# Altium schematic sheet ADC5G_POWER.SchDoc: FMC 5GS/s ADC/TDC
size 420 x 297 mm; Author: Agnieszka Bartkowicz; CompanyName: WUT ISE; DrawnBy: Agnieszka Bartkowicz; Engineer: Agnieszka Bartkowicz; Organization: WUT ISE; Address1: PW ISE; Address2: Nowowiejska 15/19 00-665 Warsaw; Address3: gyorka@o2.pl; SheetNumber: 5; SheetTotal: 13; ModifiedBy: -; CheckedDate: -; Title2: Title 2; DivGrp: WUT ISE; Designer: A. Bartkowicz
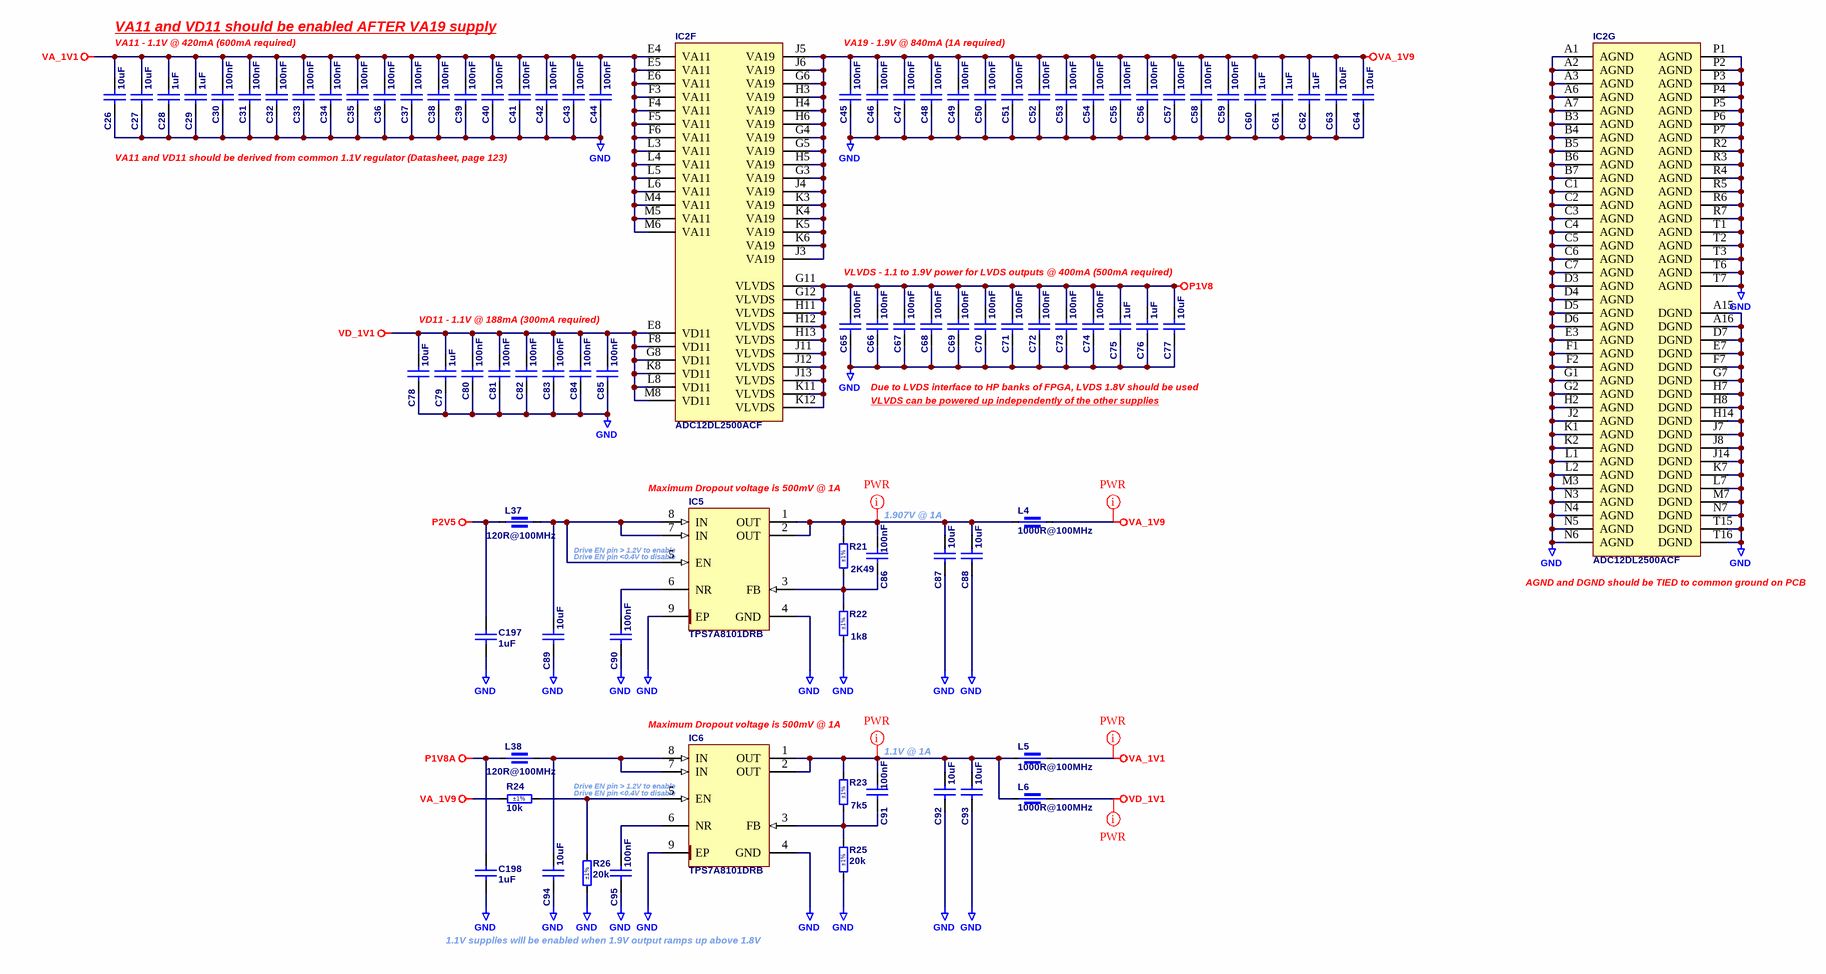
[diagram p0: ADC5G_POWER.SchDoc]

## Parts
C26  10uF  [CAPC1608X90N]
C27  10uF  [CAPC1608X90N]
C28  1uF  [CAPC1005X55N]
C29  1uF  [CAPC1005X55N]
C30  100nF  [CAPC0603X33N]
C31  100nF  [CAPC0603X33N]
C32  100nF  [CAPC0603X33N]
C33  100nF  [CAPC0603X33N]
C34  100nF  [CAPC0603X33N]
C35  100nF  [CAPC0603X33N]
C36  100nF  [CAPC0603X33N]
C37  100nF  [CAPC0603X33N]
C38  100nF  [CAPC0603X33N]
C39  100nF  [CAPC0603X33N]
C40  100nF  [CAPC0603X33N]
C41  100nF  [CAPC0603X33N]
C42  100nF  [CAPC0603X33N]
C43  100nF  [CAPC0603X33N]
C44  100nF  [CAPC0603X33N]
C45  100nF  [CAPC0603X33N]
C46  100nF  [CAPC0603X33N]
C47  100nF  [CAPC0603X33N]
C48  100nF  [CAPC0603X33N]
C49  100nF  [CAPC0603X33N]
C50  100nF  [CAPC0603X33N]
C51  100nF  [CAPC0603X33N]
C52  100nF  [CAPC0603X33N]
C53  100nF  [CAPC0603X33N]
C54  100nF  [CAPC0603X33N]
C55  100nF  [CAPC0603X33N]
C56  100nF  [CAPC0603X33N]
C57  100nF  [CAPC0603X33N]
C58  100nF  [CAPC0603X33N]
C59  100nF  [CAPC0603X33N]
C60  1uF  [CAPC1005X55N]
C61  1uF  [CAPC1005X55N]
C62  1uF  [CAPC1005X55N]
C63  10uF  [CAPC1608X90N]
C64  10uF  [CAPC1608X90N]
C65  100nF  [CAPC0603X33N]
C66  100nF  [CAPC0603X33N]
C67  100nF  [CAPC0603X33N]
C68  100nF  [CAPC0603X33N]
C69  100nF  [CAPC0603X33N]
C70  100nF  [CAPC0603X33N]
C71  100nF  [CAPC0603X33N]
C72  100nF  [CAPC0603X33N]
C73  100nF  [CAPC0603X33N]
C74  100nF  [CAPC0603X33N]
C75  1uF  [CAPC1005X55N]
C76  1uF  [CAPC1005X55N]
C77  10uF  [CAPC1608X90N]
C78  10uF  [CAPC1608X90N]
C79  1uF  [CAPC1005X55N]
C80  100nF  [CAPC0603X33N]
C81  100nF  [CAPC0603X33N]
C82  100nF  [CAPC0603X33N]
C83  100nF  [CAPC0603X33N]
C84  100nF  [CAPC0603X33N]
C85  100nF  [CAPC0603X33N]
C86  100nF  [CAPC1005X55N]
C87  10uF  [CAPC1608X90N]
C88  10uF  [CAPC1608X90N]
C89  10uF  [CAPC1608X90N]
C90  100nF  [CAPC1005X55N]
C91  100nF  [CAPC1005X55N]
C92  10uF  [CAPC1608X90N]
C93  10uF  [CAPC1608X90N]
C94  10uF  [CAPC1608X90N]
C95  100nF  [CAPC1005X55N]
C197  1uF  [CAPC1005X55N]
C198  1uF  [CAPC1005X55N]
IC2  ADC12DL2500ACF  [BGA256C100P16X16_1700X1700X331]  (parts F,G of 7)
IC5  TPS7A8101DRB  [TEXAS_DRB(S-PVSON-N8)]
IC6  TPS7A8101DRB  [TEXAS_DRB(S-PVSON-N8)]
L4  1000R@100MHz  [INDC1608X95N]
L5  1000R@100MHz  [INDC1608X95N]
L6  1000R@100MHz  [INDC1608X95N]
L37  120R@100MHz  [INDC1005X55N]
L38  120R@100MHz  [INDC1005X55N]
R21  2K49  Tolerance: ±1%  [RESC1005X40N]
R22  1k8  Tolerance: ±1%  [RESC1005X40N]
R23  7k5  Tolerance: ±1%  [RESC1005X40N]
R24  10k  Tolerance: ±1%  [RESC1005X40N]
R25  20k  Tolerance: ±1%  [RESC1005X40N]
R26  20k  Tolerance: ±1%  [RESC1005X40N]

## Nets
GND: C26.1 C27.1 C28.1 C29.1 C30.1 C31.1 C32.1 C33.1 C34.1 C35.1 C36.1 C37.1 C38.1 C39.1 C40.1 C41.1 C42.1 C43.1 C44.1 C45.1 C46.1 C47.1 C48.1 C49.1 C50.1 C51.1 C52.1 C53.1 C54.1 C55.1 C56.1 C57.1 C58.1 C59.1 C60.1 C61.1 C62.1 C63.1 C64.1 C65.1 C66.1 C67.1 C68.1 C69.1 C70.1 C71.1 C72.1 C73.1 C74.1 C75.1 C76.1 C77.1 C78.1 C79.1 C80.1 C81.1 C82.1 C83.1 C84.1 C85.1 C87.1 C88.1 C89.1 C90.1 C92.1 C93.1 C94.1 C95.1 C197.1 C198.1 IC2.A1(AGND) IC2.A2(AGND) IC2.A3(AGND) IC2.A6(AGND) IC2.A7(AGND) IC2.A15(DGND) IC2.A16(DGND) IC2.B3(AGND) IC2.B4(AGND) IC2.B5(AGND) IC2.B6(AGND) IC2.B7(AGND) IC2.C1(AGND) IC2.C2(AGND) IC2.C3(AGND) IC2.C4(AGND) IC2.C5(AGND) IC2.C6(AGND) IC2.C7(AGND) IC2.D3(AGND) IC2.D4(AGND) IC2.D5(AGND) IC2.D6(AGND) IC2.D7(DGND) IC2.E3(AGND) IC2.E7(DGND) IC2.F1(AGND) IC2.F2(AGND) IC2.F7(DGND) IC2.G1(AGND) IC2.G2(AGND) IC2.G7(DGND) IC2.H2(AGND) IC2.H7(DGND) IC2.H8(DGND) IC2.H14(DGND) IC2.J2(AGND) IC2.J7(DGND) IC2.J8(DGND) IC2.J14(DGND) IC2.K1(AGND) IC2.K2(AGND) IC2.K7(DGND) IC2.L1(AGND) IC2.L2(AGND) IC2.L7(DGND) IC2.M3(AGND) IC2.M7(DGND) IC2.N3(AGND) IC2.N4(AGND) IC2.N5(AGND) IC2.N6(AGND) IC2.N7(DGND) IC2.P1(AGND) IC2.P2(AGND) IC2.P3(AGND) IC2.P4(AGND) IC2.P5(AGND) IC2.P6(AGND) IC2.P7(AGND) IC2.R2(AGND) IC2.R3(AGND) IC2.R4(AGND) IC2.R5(AGND) IC2.R6(AGND) IC2.R7(AGND) IC2.T1(AGND) IC2.T2(AGND) IC2.T3(AGND) IC2.T6(AGND) IC2.T7(AGND) IC2.T15(DGND) IC2.T16(DGND) IC5.4(GND) IC5.9(EP) IC6.4(GND) IC6.9(EP) R22.1 R25.1 R26.1
P1V8: C65.2 C66.2 C67.2 C68.2 C69.2 C70.2 C71.2 C72.2 C73.2 C74.2 C75.2 C76.2 C77.2 IC2.G11(VLVDS) IC2.G12(VLVDS) IC2.H11(VLVDS) IC2.H12(VLVDS) IC2.H13(VLVDS) IC2.J11(VLVDS) IC2.J12(VLVDS) IC2.J13(VLVDS) IC2.K11(VLVDS) IC2.K12(VLVDS)
P1V8A: C198.2 L38.1
P2V5: C197.2 L37.1
VA_1V1: C26.2 C27.2 C28.2 C29.2 C30.2 C31.2 C32.2 C33.2 C34.2 C35.2 C36.2 C37.2 C38.2 C39.2 C40.2 C41.2 C42.2 C43.2 C44.2 IC2.E4(VA11) IC2.E5(VA11) IC2.E6(VA11) IC2.F3(VA11) IC2.F4(VA11) IC2.F5(VA11) IC2.F6(VA11) IC2.L3(VA11) IC2.L4(VA11) IC2.L5(VA11) IC2.L6(VA11) IC2.M4(VA11) IC2.M5(VA11) IC2.M6(VA11) L5.2
VA_1V9: C45.2 C46.2 C47.2 C48.2 C49.2 C50.2 C51.2 C52.2 C53.2 C54.2 C55.2 C56.2 C57.2 C58.2 C59.2 C60.2 C61.2 C62.2 C63.2 C64.2 IC2.G3(VA19) IC2.G4(VA19) IC2.G5(VA19) IC2.G6(VA19) IC2.H3(VA19) IC2.H4(VA19) IC2.H5(VA19) IC2.H6(VA19) IC2.J3(VA19) IC2.J4(VA19) IC2.J5(VA19) IC2.J6(VA19) IC2.K3(VA19) IC2.K4(VA19) IC2.K5(VA19) IC2.K6(VA19) L4.2 R24.1
VD_1V1: C78.2 C79.2 C80.2 C81.2 C82.2 C83.2 C84.2 C85.2 IC2.E8(VD11) IC2.F8(VD11) IC2.G8(VD11) IC2.K8(VD11) IC2.L8(VD11) IC2.M8(VD11) L6.2
NetC86_1: C86.1 IC5.3(FB) R21.1 R22.2
NetC86_2: C86.2 C87.2 C88.2 IC5.1(OUT) IC5.2(OUT) L4.1 R21.2
NetC89_2: C89.2 IC5.5(EN) IC5.7(IN) IC5.8(IN) L37.2
NetC90_2: C90.2 IC5.6(NR)
NetC91_1: C91.1 IC6.3(FB) R23.1 R25.2
NetC91_2: C91.2 C92.2 C93.2 IC6.1(OUT) IC6.2(OUT) L5.1 L6.1 R23.2
NetC94_2: C94.2 IC6.7(IN) IC6.8(IN) L38.2
NetC95_2: C95.2 IC6.6(NR)
NetIC6_5: IC6.5(EN) R24.2 R26.2

## Layout directives
net class PWR: NetC86_2, NetC91_2, VA_1V1, VA_1V9, VD_1V1

## Notes on the sheet
- VA11 - 1.1V @ 420mA (600mA required)
- VA11 and VD11 should be enabled AFTER VA19 supply
- VA19 - 1.9V @ 840mA (1A required)
- VA11 and VD11 should be derived from common 1.1V regulator (Datasheet, page 123)
- VLVDS - 1.1 to 1.9V power for LVDS outputs @ 400mA (500mA required)
- VD11 - 1.1V @ 188mA (300mA required)
- Due to LVDS interface to HP banks of FPGA, LVDS 1.8V should be used
- VLVDS can be powered up independently of the other supplies
- (near IC5) Maximum Dropout voltage is 500mV @ 1A
- (near IC5) Drive EN pin > 1.2V to enable
- 1.907V @ 1A
- (near IC5) Drive EN pin <0.4V to disable
- (near IC2) AGND and DGND should be TIED to common ground on PCB
- (near IC6) Maximum Dropout voltage is 500mV @ 1A
- 1.1V @ 1A
- (near IC6) Drive EN pin > 1.2V to enable
- (near IC6) Drive EN pin <0.4V to disable
- 1.1V supplies will be enabled when 1.9V output ramps up above 1.8V
- Project/Equipment
- Document
- Designer
- Drawn by
- Check.by
- Copyright WUT ISE 2024.
  This documentation describes Open Hardware and is licensed under the CERN OHL v.2. You may redistribute and modify this documentation under the terms of the CERN OHL v.2. (http://ohwr.org/CERNOHL). This documentation is distributed WITHOUT ANY EXPRESS OR IMPLIED WARRANTY, INCLUDING OF MERCHANTABILITY, SATISFACTORY QUALITY AND FITNESS FOR A PARTICULAR PURPOSE. Please see the CERN OHL v.2 for applicable conditions.
- Contact
- File
- Last Mod.
- Print Date
- Sheet
- Size
- A3
- of
- Rev

## Library data of the parts
C26 C27 C63 C64 C77 C78 C87-C89 C92-C94 = CC0603_10UF_16V_10%_X5R_MURATA_GRT188R61C106KE13: Non-polarised capacitor; Part Description: AEC-Q200 Compliant Chip Multilayer Ceramic Capacitor; Manufacturer: MURATA; Voltage: 16V; TC: X5R; Tolerance: ±10%; Part Number: CC0603_10UF_16V_10%_X5R_MURATA_GRT188R61C106KE13; Component Kind: Standard; Component Type: Standard; Pin Count: 2; Value: 10uF; Status: None; Manufacturer Part Number: GRT188R61C106KE13; Case: 0603; Mounted: Yes; Socket: No; SMD: Yes; Sense: No; ComponentHeight: 0.9mm; HelpURL: \\cern.ch\dfs\Applications\Altium\Datasheets\CC0603_MURATA_GRT188R61C106KE13.pdf; Author: CERN DEM HF; CreateDate: 16.06.2022; LatestRevisionDate: 17.06.2022
C28 C29 C60-C62 C75 C76 C79 = CC0402_1UF_16V_10%_X5R: Non-polarised capacitor; Part Description: SMD Multilayer Chip Ceramic Capacitor; Manufacturer: GENERIC; Manufacturer1 Part Number: C1005X5R1C105KT; Voltage: 16V; TC: X5R; Tolerance: ±10%; Part Number: CC0402_1UF_16V_10%_X5R; Component Kind: Standard; Component Type: Standard; Pin Count: 2; Value: 1uF; Status: Preferred; Manufacturer Part Number: CC0402_1UF_16V_10%_X5R; Case: 0402; Mounted: Yes; Socket: No; SMD: Yes; Sense: No; Manufacturer1 Example: TDK; Manufacturer1 ComponentHeight: 0.55mm; HelpURL: \\cern.ch\dfs\Applications\Altium\Datasheets\CC0402_X5R_TDK_C.pdf; Author: CERN DEM JLC; CreateDate: 25.10.2012; LatestRevisionDate: 25.10.2012
C30-C59 C65-C74 C80-C85 = CC0201_100NF_6.3V_10%_X7R: Non-polarised capacitor; Part Description: SMD Multilayer Chip Ceramic Capacitor; Manufacturer: GENERIC; Manufacturer1 Part Number: CC0201KRX7R5BB104; Voltage: 6.3V; TC: X7R; Tolerance: ±10%; Part Number: CC0201_100NF_6.3V_10%_X7R; Component Kind: Standard; Component Type: Standard; Pin Count: 2; Value: 100nF; Status: Not Recommended; Manufacturer Part Number: CC0201_100NF_6.3V_10%_X7R; Case: 0201; Mounted: Yes; Socket: No; SMD: Yes; Sense: No; Manufacturer1 Example: YAGEO PHYCOMP; Manufacturer1 ComponentHeight: 0.33mm; HelpURL: \\cern.ch\dfs\Applications\Altium\Datasheets\CC0201_X7R_YAGEO_6.3VTO50V.pdf; Author: CERN DEM BC; CreateDate: 20.11.2020; LatestRevisionDate: 20.11.2020
C86 C90 C91 C95 = CC0402_100NF_16V_10%_X5R: Non-polarised capacitor; Part Description: SMD Multilayer Chip Ceramic Capacitor; Manufacturer: GENERIC; Manufacturer1 Part Number: GRM155R61C104KA88D; Voltage: 16V; TC: X5R; Tolerance: ±10%; Part Number: CC0402_100NF_16V_10%_X5R; Component Kind: Standard; Component Type: Standard; Pin Count: 2; Value: 100nF; Status: None; Manufacturer Part Number: CC0402_100NF_16V_10%_X5R; Case: 0402; Mounted: Yes; Socket: No; SMD: Yes; Sense: No; Manufacturer1 Example: MURATA; Manufacturer1 ComponentHeight: 0.55mm; HelpURL: \\cern.ch\dfs\Applications\Altium\Datasheets\CC0402_X5R_MURATA_GRM.pdf; Author: CERN DEM JLC; CreateDate: 10.12.2013; LatestRevisionDate: 10.12.2013
C197 C198 = CC0402_1UF_25V_10%_X5R: Non-polarised capacitor; Part Description: SMD Multilayer Chip Ceramic Capacitor; Manufacturer: GENERIC; Manufacturer1 Part Number: C1005X5R1E105K050; Voltage: 25V; TC: X5R; Tolerance: ±10%; Part Number: CC0402_1UF_25V_10%_X5R; Component Kind: Standard; Component Type: Standard; Pin Count: 2; Value: 1uF; Status: Preferred; Manufacturer Part Number: CC0402_1UF_25V_10%_X5R; Case: 0402; Mounted: Yes; Socket: No; SMD: Yes; Sense: No; Manufacturer1 Example: TDK; Manufacturer1 ComponentHeight: 0.55mm; HelpURL: \\cern.ch\dfs\Applications\Altium\Datasheets\CC0402_X5R_TDK_C.pdf; Author: CERN DEM BC; CreateDate: 17.02.2020; LatestRevisionDate: 17.02.2020
IC2 = ADC12DL2500ACF: Single-Supply, Multichannel, 125kSPS, 24-Bit, Sigma-Delta ADC with ±10V Inputs; Part Description: 1.5 GSPS Dual-Channel or 1, 3, 5GSPS Single-Channel,12-Bit Analog-to-Digital Converters (ADC) With LVDS Interface; Manufacturer: TEXAS INSTRUMENTS; PressFit: No; Bonding: No; Part Number: ADC12DL2500ACF; Component Kind: Standard; Component Type: Standard; Device: ADC12DL2500ACF; PackageDescription: BGA, 1.00mm Pitch, Square; 156 Pin, 16 Columns X 16 Rows, 17.0mm X 17.0mm X 3.31mm H body, IPC Medium Density; Manufacturer Part Number: ADC12DL2500ACF; Pin Count: 256; Case: BGA256; Mounted: Yes; Socket: No; SMD: Yes; Sense: No; ComponentHeight: 3.31mm; Author: CERN DEM HF; HelpURL: \\cern.ch\dfs\Applications\Altium\Datasheets\ADC12DLX500ACF.pdf; CreateDate: 04.12.2024; LatestRevisionDate: 04.12.2024
IC5 IC6 = TPS7A8101DRB: 0.8V to 6V, 1A, Low-Noise, Wide-Bandwidth, High PSRR, Low-Dropout Linear Regulator; Manufacturer: TEXAS INSTRUMENTS; PressFit: No; Bonding: No; Part Number: TPS7A8101DRB; Component Kind: Standard; Component Type: Standard; Device: TPS7A8101DRB; PackageDescription: TEXAS Case Style DRB (S-PVSON-N8), SON, 0.65mm Pitch; 8 Pin, 3.00mm W X 3.00mm L X 1.00mm H body (w/Thermal Tab 1.60 X 1.85mm); Part Description: 0.8V to 6V, 1A, Low-Noise, Wide-Bandwidth, High PSRR, Low-Dropout Linear Regulator; Manufacturer Part Number: TPS7A8101DRB; Pin Count: 9; Case: SON8; Mounted: Yes; Socket: No; SMD: Yes; Sense: No; ComponentHeight: 1mm; HelpURL: \\cern.ch\dfs\Applications\Altium\Datasheets\TPS7A8101DRB.pdf; Author: CERN DEM BC; CreateDate: 18.02.2019; LatestRevisionDate: 18.02.2019
L4-L6 = IND0603_MURATA_BLM18KG102SN1: Part Description: SMD Chip Ferrite Bead, Automotive; Manufacturer: MURATA; Manufacturer Part Number: BLM18KG102WH1; Power: 1A; Resistance: 0.2R; Tolerance: ±25%; Part Number: IND0603_MURATA_BLM18KG102SN1; Component Kind: Standard; Component Type: Standard; Pin Count: 2; Value: 1000R@100MHz; Case: 0603; Mounted: Yes; Socket: No; SMD: Yes; Sense: No; ComponentHeight: 0.95mm; HelpURL: \\cern.ch\dfs\Applications\Altium\Datasheets\IND0603_MURATA_BLM18KG102SN1.pdf; Author: CERN DEM HF; CreateDate: 15.12.2022; LatestRevisionDate: 15.12.2022
L37 L38 = IND0402_MURATA_BLM15PX121SN1D: Part Description: SMD EMIFIL Chip Ferrite Bead; Manufacturer: MURATA; Power: 2A; Resistance: 0.055R; Tolerance: ±25%; Part Number: IND0402_MURATA_BLM15PX121SN1D; Component Kind: Standard; Component Type: Standard; Pin Count: 2; Value: 120R@100MHz; Manufacturer Part Number: BLM15PX121SN1D; Case: 0402; Mounted: Yes; Socket: No; SMD: Yes; Sense: No; ComponentHeight: 0.55mm; HelpURL: \\cern.ch\dfs\Applications\Altium\Datasheets\IND0402_MURATA_BLM15PX.pdf; Author: CERN DEM JMW; CreateDate: 19.02.2014; LatestRevisionDate: 25.10.2018
R21 = R0402_2K49_1%_0.063W_100PPM: Resistor - 1%; Part Description: General Purpose Thick Film Chip Resistor; Manufacturer: GENERIC; Manufacturer1 Part Number: CRCW04022K49FK; Power: 0.063W; TC: ±100ppm/°C; PressFit: No; Part Number: R0402_2K49_1%_0.063W_100PPM; Component Kind: Standard; Component Type: Standard; Pin Count: 2; Value: 2K49; Status: None; Manufacturer Part Number: R0402_2K49_1%_0.063W_100PPM; Case: 0402; Mounted: Yes; Sense: No; Socket: No; SMD: Yes; Manufacturer1 Example: VISHAY; Manufacturer1 ComponentHeight: 0.4mm; HelpURL: \\cern.ch\dfs\Applications\Altium\Datasheets\R0402_VISHAY_CRCW e3.pdf; Author: CERN DEM BC; CreateDate: 10.01.2020; LatestRevisionDate: 10.01.2020
R22 = R0402_1K8_1%_0.0625W_100PPM: Resistor - 1%; Part Description: General Purpose Thick Film Chip Resistor; Manufacturer: GENERIC; Manufacturer1 Part Number: 232270671802L; TC: ±100ppm/°C; PressFit: No; Part Number: R0402_1K8_1%_0.0625W_100PPM; Component Kind: Standard; Component Type: Standard; Pin Count: 2; Value: 1k8; Status: Not Recommended; Power: 0.0625W; Manufacturer Part Number: R0402_1K8_1%_0.0625W_100PPM; Case: 0402; Mounted: Yes; Sense: No; Socket: No; SMD: Yes; Manufacturer1 Example: YAGEO PHYCOMP; Manufacturer1 ComponentHeight: 0.4mm; HelpURL: \\cern.ch\dfs\Applications\Altium\Datasheets\R0402_Phycomp_RC0402.pdf; Author: CERN DEM JLC; CreateDate: 03.12.2007; LatestRevisionDate: 17.10.2012
R23 = R0402_7K5_1%_0.0625W_100PPM: Resistor - 1%; Part Description: General Purpose Thick Film Chip Resistor; Manufacturer: GENERIC; Manufacturer1 Part Number: 232270677502L; TC: ±100ppm/°C; PressFit: No; Part Number: R0402_7K5_1%_0.0625W_100PPM; Component Kind: Standard; Component Type: Standard; Pin Count: 2; Value: 7k5; Status: Not Recommended; Power: 0.0625W; Manufacturer Part Number: R0402_7K5_1%_0.0625W_100PPM; Case: 0402; Mounted: Yes; Sense: No; Socket: No; SMD: Yes; Manufacturer1 Example: YAGEO PHYCOMP; Manufacturer1 ComponentHeight: 0.4mm; HelpURL: \\cern.ch\dfs\Applications\Altium\Datasheets\R0402_Phycomp_RC0402.pdf; Author: CERN DEM JLC; CreateDate: 03.12.2007; LatestRevisionDate: 17.10.2012
R24 = R0402_10K_1%_0.0625W_100PPM: Resistor - 1%; Part Description: General Purpose Thick Film Chip Resistor; Manufacturer: GENERIC; Manufacturer1 Part Number: 232270671003L; TC: ±100ppm/°C; PressFit: No; Part Number: R0402_10K_1%_0.0625W_100PPM; Component Kind: Standard; Component Type: Standard; Pin Count: 2; Value: 10k; Status: Not Recommended; Power: 0.0625W; Manufacturer Part Number: R0402_10K_1%_0.0625W_100PPM; Case: 0402; Mounted: Yes; Sense: No; Socket: No; SMD: Yes; Manufacturer1 Example: YAGEO PHYCOMP; Manufacturer1 ComponentHeight: 0.4mm; HelpURL: \\cern.ch\dfs\Applications\Altium\Datasheets\R0402_Phycomp_RC0402.pdf; Author: CERN DEM JLC; CreateDate: 03.12.2007; LatestRevisionDate: 17.10.2012
R25 R26 = R0402_20K_1%_0.0625W_100PPM: Resistor - 1%; Part Description: General Purpose Thick Film Chip Resistor; Manufacturer: GENERIC; Manufacturer1 Part Number: 232270672003L; TC: ±100ppm/°C; PressFit: No; Part Number: R0402_20K_1%_0.0625W_100PPM; Component Kind: Standard; Component Type: Standard; Pin Count: 2; Value: 20k; Status: Not Recommended; Power: 0.0625W; Manufacturer Part Number: R0402_20K_1%_0.0625W_100PPM; Case: 0402; Mounted: Yes; Sense: No; Socket: No; SMD: Yes; Manufacturer1 Example: YAGEO PHYCOMP; Manufacturer1 ComponentHeight: 0.4mm; HelpURL: \\cern.ch\dfs\Applications\Altium\Datasheets\R0402_Phycomp_RC0402.pdf; Author: CERN DEM JLC; CreateDate: 03.12.2007; LatestRevisionDate: 17.10.2012